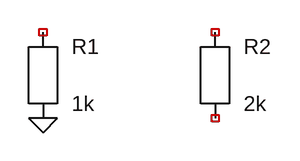
[diagram p0: schematic unconnected_pins.asc]
unconnected_pins.asc, the LTspice schematic file:
Version 4
SHEET 1 880 680
SYMBOL res 96 144 R0
SYMATTR InstName R1
SYMATTR Value 1k
SYMBOL res 288 144 R0
SYMATTR InstName R2
SYMATTR Value 2k
FLAG 96 192 0

The netlist it stands for:
* unconnected_pins.asc
R1 NC_01 0 1k
R2 NC_02 NC_03 2k
.backanno
.end